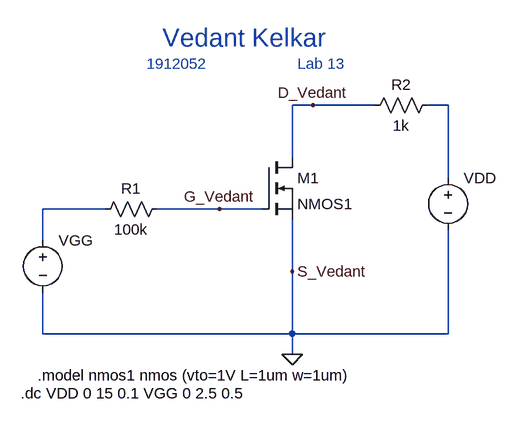
[diagram p0: schematic Draft27.asc]
Draft27.asc, the LTspice schematic file:
Version 4
SHEET 1 880 680
WIRE 224 -48 192 -48
WIRE 320 -48 224 -48
WIRE 432 -48 400 -48
WIRE 192 32 192 -48
WIRE 432 64 432 -48
WIRE -96 112 -192 112
WIRE 80 112 -16 112
WIRE 144 112 80 112
WIRE -192 160 -192 112
WIRE 192 208 192 128
WIRE -192 304 -192 240
WIRE 192 304 192 208
WIRE 192 304 -192 304
WIRE 432 304 432 144
WIRE 432 304 192 304
WIRE 192 336 192 304
FLAG 192 336 0
FLAG 224 -48 D_Vedant
FLAG 80 112 G_Vedant
FLAG 192 208 S_Vedant
SYMBOL nmos 144 32 R0
SYMATTR InstName M1
SYMATTR Value NMOS1
SYMBOL res 0 96 R90
WINDOW 0 0 56 VBottom 2
WINDOW 3 32 56 VTop 2
SYMATTR InstName R1
SYMATTR Value 100k
SYMBOL res 416 -64 R90
WINDOW 0 0 56 VBottom 2
WINDOW 3 32 56 VTop 2
SYMATTR InstName R2
SYMATTR Value 1k
SYMBOL voltage -192 144 R0
WINDOW 123 0 0 Left 0
WINDOW 39 0 0 Left 0
SYMATTR InstName VGG
SYMATTR Value ""
SYMBOL voltage 432 48 R0
WINDOW 123 0 0 Left 0
WINDOW 39 0 0 Left 0
SYMATTR InstName VDD
SYMATTR Value ""
TEXT -8 -152 Left 4 ;Vedant Kelkar
TEXT -32 -112 Left 2 ;1912052
TEXT 200 -112 Left 2 ;Lab 13
TEXT -200 368 Left 2 !.model nmos1 nmos (vto=1V L=1um w=1um)
TEXT -226 396 Left 2 !.dc VDD 0 15 0.1 VGG 0 2.5 0.5

The netlist it stands for:
* Draft27.asc
M1 D_Vedant G_Vedant 0 0 NMOS1
R1 G_Vedant N002 100k
R2 N001 D_Vedant 1k
VGG N002 0
VDD N001 0
.model NMOS NMOS
.model PMOS PMOS
.lib standard.mos
* Vedant Kelkar
* 1912052
* Lab 13
.model nmos1 nmos (vto=1V L=1um w=1um)
.dc VDD 0 15 0.1 VGG 0 2.5 0.5
.backanno
.end